# Altium schematic sheet ClosedLoop_Drive_MC_Sensors.SchDoc
size A4; SheetNumber: 4; SheetTotal: 8
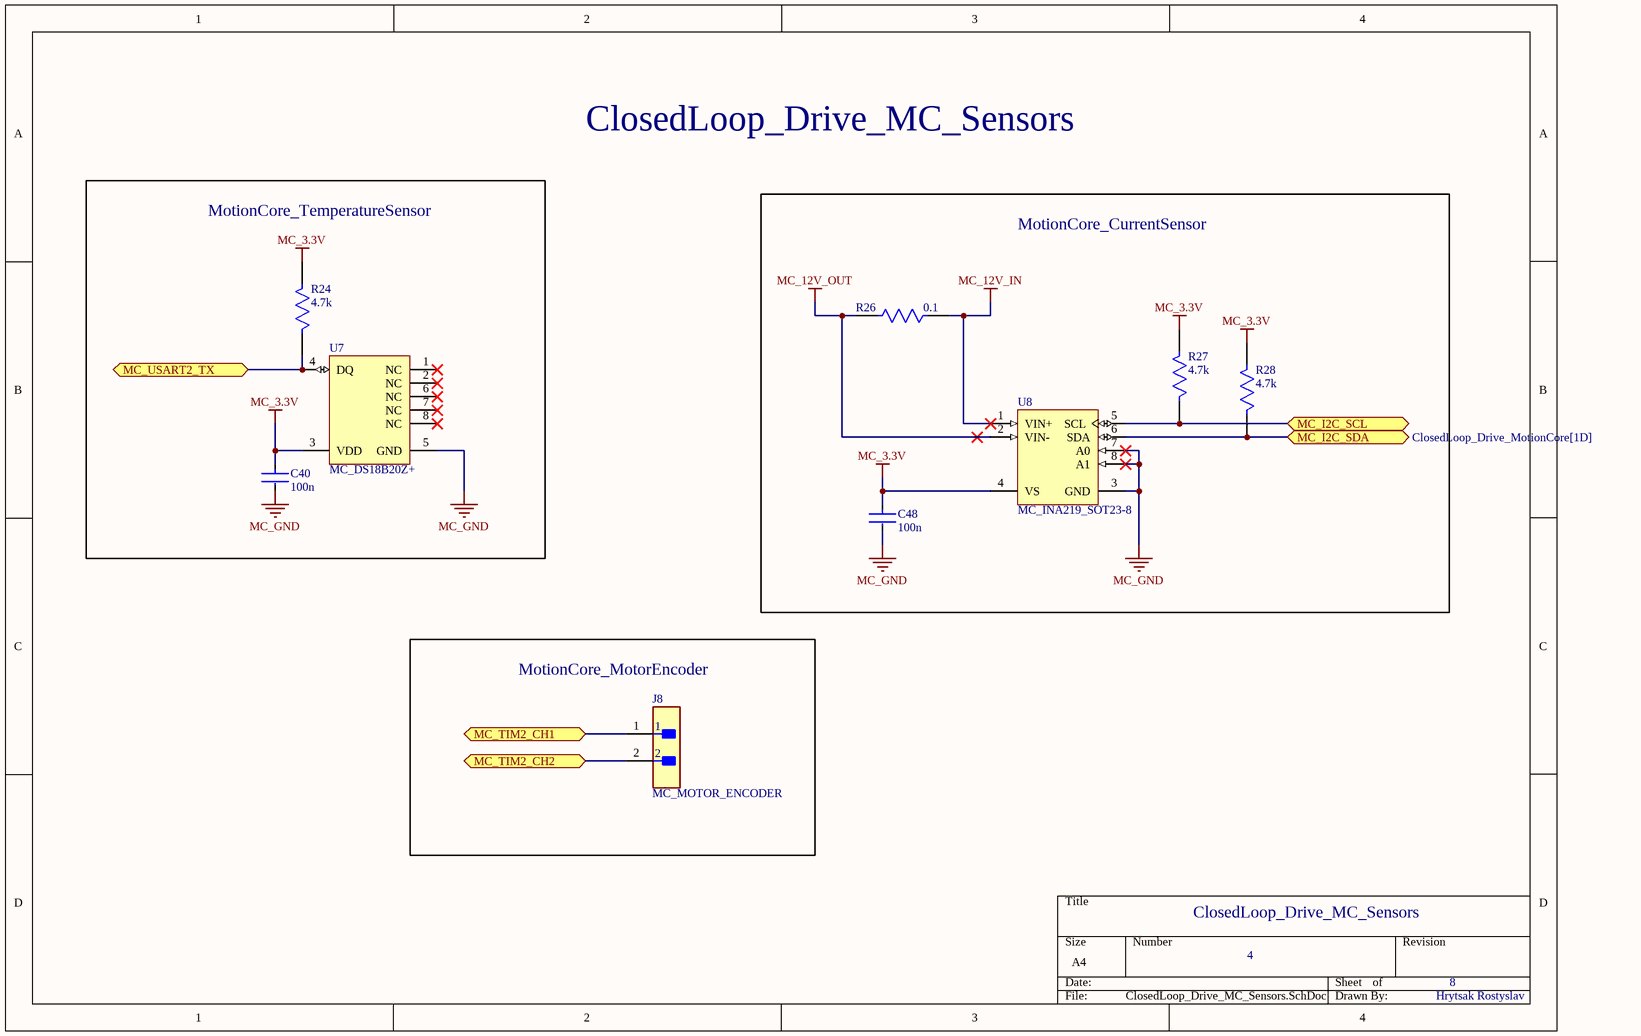
[diagram p0: ClosedLoop_Drive_MC_Sensors.SchDoc]

## Parts
C40  100n  [FP-0805-L_2_01_0_2-W_1_25-MFG]
C48  100n  [FP-0805-L_2_01_0_2-W_1_25-MFG]
J8  MC_MOTOR_ENCODER  [FP-TSW-102-07-F-S-MFG]
R24  4.7k  [FP-MCU0805-IPC_A]
R26  0.1  [FP-CRA2512-IPC_C]
R27  4.7k  [FP-MCU0805-IPC_A]
R28  4.7k  [FP-MCU0805-IPC_A]
U7  MC_DS18B20Z+  [MAXM-S8+2_L]
U8  MC_INA219_SOT23-8  [DCN0008A_L]

## Blocks framed on the sheet
MotionCore_TemperatureSensor: C40 R24 U7
MotionCore_CurrentSensor: C48 R26-R28 U8
MotionCore_MotorEncoder: J8

## Ports
MC_I2C_SCL (bidir, see ClosedLoop_Drive_MotionCore[1D]), MC_I2C_SDA (bidir, see ClosedLoop_Drive_MotionCore[1D]), MC_TIM2_CH1 (bidir, see ClosedLoop_Drive_MotionCore[1C]), MC_TIM2_CH2 (bidir, see ClosedLoop_Drive_MotionCore[1C]), MC_USART2_TX (bidir, see ClosedLoop_Drive_MotionCore[1C])

## Nets
MC_3.3V: C40.1 C48.1 R24.2 R27.2 R28.2 U7.3(VDD) U8.4(VS)
MC_12V_IN: R26.1 U8.1(VIN+)
MC_12V_OUT: R26.2 U8.2(VIN-)
MC_GND: C40.2 C48.2 U7.5(GND) U8.3(GND) U8.7(A0) U8.8(A1)
MC_I2C_SCL: R27.1 U8.5(SCL) ; port MC_I2C_SCL
MC_I2C_SDA: R28.1 U8.6(SDA) ; port MC_I2C_SDA
MC_TIM2_CH1: J8.1 ; port MC_TIM2_CH1
MC_TIM2_CH2: J8.2 ; port MC_TIM2_CH2
MC_USART2_TX: R24.1 U7.4(DQ) ; port MC_USART2_TX

Not connected (* = marked no-connect by the designer): U7 1(NC)* 2(NC)* 6(NC)* 7(NC)* 8(NC)*

## Notes on the sheet
- ClosedLoop_Drive_MC_Sensors
- 4
- 8
- Hrytsak Rostyslav

## Library data of the parts
C40 C48 = CMP-07738-122049624-1: 0805; Tolerance: 10%; Dielectric: X7R; Material: Ceramic; Voltage Rating (DC): 100V; Capacitance: 1µF; Case/Package: 0805; Height: 1.4mm; Voltage Rating: 100V; Schedule B: 8532240020; NexarPartId: 122049624; RoHS: Compliant; Lifecycle Status: Production; Min Operating Temperature: -55°C; Max Operating Temperature: 125°C
J8 = CMP-02766-001458-1: CONN HEADER VERT 2POS 2.54MM; Gender: Male; Max Current Rating: 7.6A; Number of Contacts: 2; Max Voltage Rating (AC): 550V; Orientation: Straight; Depth: 2.54mm; Series: TSW; Package Quantity: 1; Min Operating Temperature: -55°C; Max Operating Temperature: 125°C; Contact Type: Male Pin; Contact Shape: Square; Color: Black; Housing Color: Black; Connector Type: Header; Fastening Type: Pull; Radiation Hardening: No; Pitch: 2.54mm; Housing Material: Polyester; Mount: Through Hole; Number of Positions: 2; Number of Rows: 1; Contact Material: Bronze; Insulation Color: Black; Contact Finish - Mating: GOLD; Termination: Solder; Insulation Material: PBT; Length: 5.08mm; Flammability Rating: UL94 V-0; Contact Mating Length: 0.23inch; REACH SVHC: No SVHC; Contact Plating: Gold; RoHS Compliant: Yes; Packaging: Bulk
R24 R27 R28 = CMP-02407-001153-1: 0805; Power Rating: 200mW; Temperature Coefficient: 25ppm/°C; Voltage Rating: 150V; Resistance: 4.99kR; Tolerance: 0.5%; Case Code (Imperial): 0805; Features: Automotive AEC-Q200; Case Code (Metric): 2012; Weight: 0.000162oz; Width: 0.049inch; Packaging: Tape and Reel; Composition: Thin Film; Height: 0.024inch; Termination: SMD/SMT; Number of Terminations: 2; Min Operating Temperature: -55°C; Length: 0.079inch; Package Quantity: 5000; Max Operating Temperature: 175°C; Case/Package: 0805; Max Power Dissipation: 200mW
R26 = CMP-07231-006698-1: RES 0.1 OHM 1% 3W 2512
U7 = CMP-0253-00019-2: High-Precision 1-Wire Digital Thermometer, -55 to 125 degC, 8-Pin SOIC (S8+2), Pb-Free; Sensor Type: Local; Temp. Thresh.: Programmable (NV); Parasite Pwr.: Yes; ComponentLink1Description: Manufacturer URL; PartNumber: DS18B20Z+; Mounting Technology: Surface Mount; ComponentLink2URL: http://datasheets.maximintegrated.com/en/ds/DS18B20.pdf; Code_JEDEC: MS012; ComponentLink2Description: Datasheet; DatasheetVersion: Rev. 4; PackageVersion: Rev. D, 10/2012; ComponentLink1URL: http://www.maximintegrated.com/; PackageReference: S8+2; ComponentLink3URL: http://pdfserv.maximintegrated.com/package_dwgs/21-0041.PDF; Interface: 1-Wire; ComponentLink3Description: Package Specification; RoHS: Pb-Free; Multi Droppable: Yes; Generic Part Number: DS18B20; PackageDescription: 8-Pin Small-Outline IC, Narrow (0.15in) (S8+2), Body 4.90 x 3.90 mm, Pitch 1.27 mm
U8 = CMP-0704-00039-2: Zero-Drift, Bi-Directional Current / Power Monitor, 3 to 5.5 V, -40 to 125 degC, 8-pin SOT23 (DCN8), Green (RoHS & no Sb/Br); Manufacturer: Texas Instruments; PartNumber: INA219AIDCNT; Input Offset (+/-)(Max)(uV): 100; Common Mode Range(Max)(V): 26; Gain(V/V): 1, 0.5, 0.25, 0.125; Vs(Min)(V): 3; Vs(Max)(V): 5.5; Small-Signal Bandwidth(Typ)(MHz): 0.011; Rating: Catalog; SubFamily: Current Shunt Monitor; Common Mode Range(Min)(V): 0; Quiescent Current (+/-)(Typ)(mA): 0.7; Code_JEDEC: MO-178; DatasheetVersion: SBOS448F; ComponentLink3URL: http://www.ti.com/lit/ml/mpds099c/mpds099c.pdf; PackageReference: DCN0008A; Eco-Plan: Green (RoHS & no Sb/Br); PackageVersion: 4202106/D, 11/2009; PackageDescription: 8-Pin Plastic Small Outline, Body 1.6 x 2.9 mm, Pitch 0.65 mm; ComponentLink3Description: Package Specification; ComponentLink1Description: Manufacturer URL; ComponentLink1URL: http://www.ti.com/; CMRR(Min)(dB): 100; Mounting Technology: Surface Mount; ComponentLink2URL: http://www.ti.com/general/docs/lit/getliterature.tsp?genericPartNumber=INA219&fileType=pdf; ComponentLink2Description: Datasheet